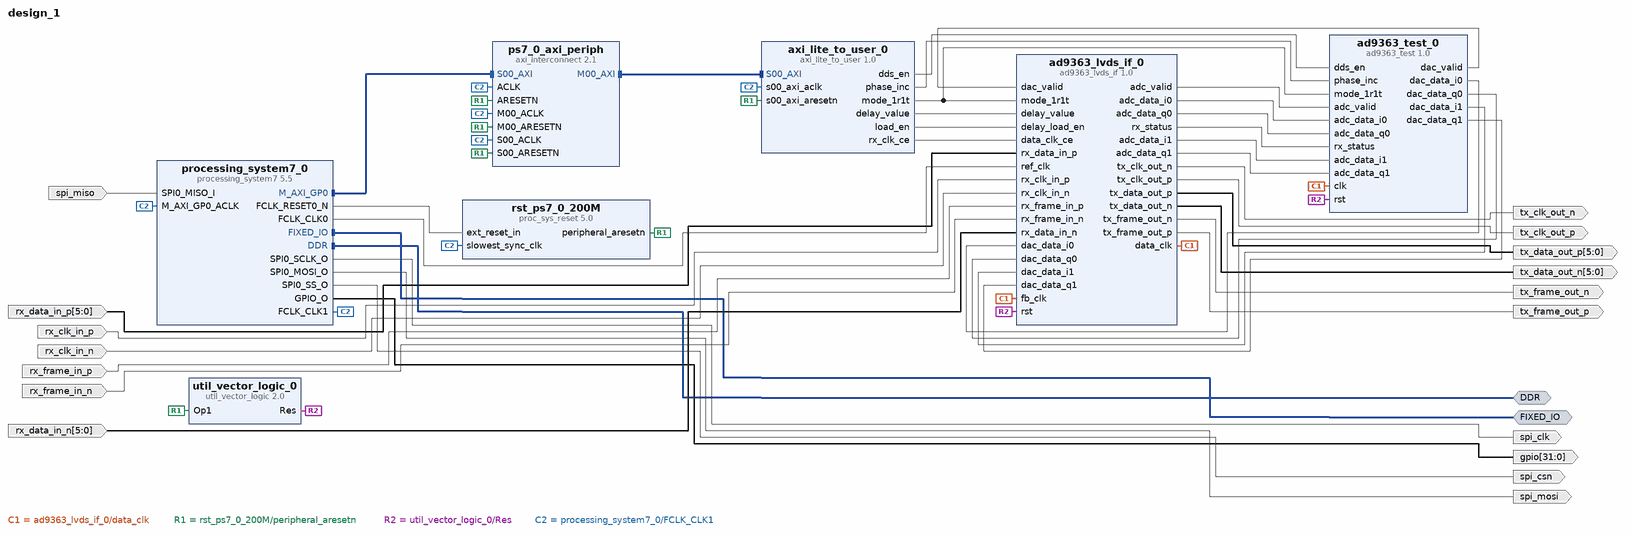
[diagram p0: block diagram of the top level]
# Vivado block design design_1, xc7z020clg400-2, Vivado 2019.2
create_bd_design design_1

create_bd_intf_port -mode Master -vlnv xilinx.com:interface:ddrx_rtl:1.0 DDR
create_bd_intf_port -mode Master -vlnv xilinx.com:display_processing_system7:fixedio_rtl:1.0 FIXED_IO
create_bd_port -dir O spi_clk
create_bd_port -dir O spi_mosi
create_bd_port -dir I spi_miso
create_bd_port -dir O spi_csn
create_bd_port -dir O -from 5 -to 0 tx_data_out_p
create_bd_port -dir O tx_clk_out_p
create_bd_port -dir O tx_clk_out_n
create_bd_port -dir O tx_frame_out_p
create_bd_port -dir O tx_frame_out_n
create_bd_port -dir O -from 5 -to 0 tx_data_out_n
create_bd_port -dir I -from 5 -to 0 rx_data_in_p
create_bd_port -dir I rx_clk_in_p
create_bd_port -dir I rx_clk_in_n
create_bd_port -dir I rx_frame_in_p
create_bd_port -dir I rx_frame_in_n
create_bd_port -dir I -from 5 -to 0 rx_data_in_n
create_bd_port -dir O -from 31 -to 0 gpio

create_bd_cell -type ip -vlnv xilinx.com:ip:processing_system7:5.5 processing_system7_0
set_property -dict [list \
  CONFIG.PCW_ENET0_ENET0_IO {MIO 16 .. 27} \
  CONFIG.PCW_ENET0_GRP_MDIO_ENABLE 1 \
  CONFIG.PCW_ENET0_GRP_MDIO_IO {MIO 52 .. 53} \
  CONFIG.PCW_ENET0_PERIPHERAL_ENABLE 1 \
  CONFIG.PCW_ENET0_RESET_ENABLE 1 \
  CONFIG.PCW_ENET0_RESET_IO {MIO 46} \
  CONFIG.PCW_ENET_RESET_ENABLE 1 \
  CONFIG.PCW_ENET_RESET_SELECT {Share reset pin} \
  CONFIG.PCW_EN_CLK1_PORT 1 \
  CONFIG.PCW_FCLK_CLK1_BUF TRUE \
  CONFIG.PCW_FPGA0_PERIPHERAL_FREQMHZ 200 \
  CONFIG.PCW_FPGA1_PERIPHERAL_FREQMHZ 40 \
  CONFIG.PCW_FPGA_FCLK1_ENABLE 1 \
  CONFIG.PCW_GPIO_EMIO_GPIO_ENABLE 1 \
  CONFIG.PCW_GPIO_EMIO_GPIO_IO 32 \
  CONFIG.PCW_GPIO_EMIO_GPIO_WIDTH 32 \
  CONFIG.PCW_GPIO_MIO_GPIO_ENABLE 1 \
  CONFIG.PCW_GPIO_MIO_GPIO_IO MIO \
  CONFIG.PCW_I2C_RESET_ENABLE 0 \
  CONFIG.PCW_PRESET_BANK1_VOLTAGE {LVCMOS 1.8V} \
  CONFIG.PCW_SD0_GRP_CD_ENABLE 0 \
  CONFIG.PCW_SD0_GRP_WP_ENABLE 0 \
  CONFIG.PCW_SD0_PERIPHERAL_ENABLE 1 \
  CONFIG.PCW_SD0_SD0_IO {MIO 40 .. 45} \
  CONFIG.PCW_SDIO_PERIPHERAL_FREQMHZ 100 \
  CONFIG.PCW_SPI0_PERIPHERAL_ENABLE 1 \
  CONFIG.PCW_SPI0_SPI0_IO EMIO \
  CONFIG.PCW_UART1_PERIPHERAL_ENABLE 1 \
  CONFIG.PCW_UART1_UART1_IO {MIO 12 .. 13} \
  CONFIG.PCW_UART_PERIPHERAL_FREQMHZ 100 \
  CONFIG.PCW_UIPARAM_DDR_BUS_WIDTH {16 Bit} \
  CONFIG.PCW_UIPARAM_DDR_PARTNO {MT41J256M16 RE-125} \
  CONFIG.PCW_USB0_PERIPHERAL_ENABLE 1 \
  CONFIG.PCW_USB0_RESET_ENABLE 1 \
  CONFIG.PCW_USB0_RESET_IO {MIO 47} \
  CONFIG.PCW_USB0_USB0_IO {MIO 28 .. 39} \
  CONFIG.PCW_USB_RESET_ENABLE 1 \
  CONFIG.PCW_USB_RESET_SELECT {Share reset pin} \
] [get_bd_cells processing_system7_0]
# 205 more settings of processing_system7_0 are not shown: defaults, MIO pin electricals, DDR timing, and values the tool derives
create_bd_cell -type ip -vlnv xilinx.com:ip:axi_interconnect:2.1 ps7_0_axi_periph
set_property -dict {CONFIG.NUM_MI 1} [get_bd_cells ps7_0_axi_periph]
create_bd_cell -type ip -vlnv xilinx.com:ip:proc_sys_reset:5.0 rst_ps7_0_200M
create_bd_cell -type ip -vlnv xilinx.com:ip:util_vector_logic:2.0 util_vector_logic_0
set_property -dict {CONFIG.C_OPERATION not CONFIG.C_SIZE 1} [get_bd_cells util_vector_logic_0]
create_bd_cell -type ip -vlnv xilinx.com:user:ad9363_lvds_if:1.0 ad9363_lvds_if_0
create_bd_cell -type ip -vlnv xilinx.com:user:axi_lite_to_user:1.0 axi_lite_to_user_0
create_bd_cell -type ip -vlnv xilinx.com:user:ad9363_test:1.0 ad9363_test_0

# ---- connections ----

connect_bd_intf_net [get_bd_intf_pins processing_system7_0/M_AXI_GP0] [get_bd_intf_pins ps7_0_axi_periph/S00_AXI]
connect_bd_intf_net [get_bd_intf_pins ps7_0_axi_periph/M00_AXI] [get_bd_intf_pins axi_lite_to_user_0/S00_AXI]
connect_bd_intf_net [get_bd_intf_ports FIXED_IO] [get_bd_intf_pins processing_system7_0/FIXED_IO]
connect_bd_intf_net [get_bd_intf_ports DDR] [get_bd_intf_pins processing_system7_0/DDR]
connect_bd_net [get_bd_pins processing_system7_0/SPI0_SCLK_O] [get_bd_ports spi_clk]
connect_bd_net [get_bd_pins processing_system7_0/SPI0_MOSI_O] [get_bd_ports spi_mosi]
connect_bd_net -net SPI0_MISO_I_0_1 [get_bd_ports spi_miso] [get_bd_pins processing_system7_0/SPI0_MISO_I]
connect_bd_net [get_bd_pins processing_system7_0/SPI0_SS_O] [get_bd_ports spi_csn]
connect_bd_net [get_bd_pins ad9363_lvds_if_0/tx_data_out_p] [get_bd_ports tx_data_out_p]
connect_bd_net [get_bd_pins ad9363_lvds_if_0/tx_clk_out_p] [get_bd_ports tx_clk_out_p]
connect_bd_net [get_bd_pins ad9363_lvds_if_0/tx_clk_out_n] [get_bd_ports tx_clk_out_n]
connect_bd_net [get_bd_pins ad9363_lvds_if_0/tx_frame_out_p] [get_bd_ports tx_frame_out_p]
connect_bd_net [get_bd_pins ad9363_lvds_if_0/tx_frame_out_n] [get_bd_ports tx_frame_out_n]
connect_bd_net [get_bd_pins ad9363_lvds_if_0/tx_data_out_n] [get_bd_ports tx_data_out_n]
connect_bd_net -net rx_data_in_p_0_1 [get_bd_ports rx_data_in_p] [get_bd_pins ad9363_lvds_if_0/rx_data_in_p]
connect_bd_net -net rx_clk_in_p_0_1 [get_bd_ports rx_clk_in_p] [get_bd_pins ad9363_lvds_if_0/rx_clk_in_p]
connect_bd_net -net rx_clk_in_n_0_1 [get_bd_ports rx_clk_in_n] [get_bd_pins ad9363_lvds_if_0/rx_clk_in_n]
connect_bd_net -net rx_frame_in_p_0_1 [get_bd_ports rx_frame_in_p] [get_bd_pins ad9363_lvds_if_0/rx_frame_in_p]
connect_bd_net -net rx_frame_in_n_0_1 [get_bd_ports rx_frame_in_n] [get_bd_pins ad9363_lvds_if_0/rx_frame_in_n]
connect_bd_net -net rx_data_in_n_0_1 [get_bd_ports rx_data_in_n] [get_bd_pins ad9363_lvds_if_0/rx_data_in_n]
connect_bd_net [get_bd_pins ad9363_lvds_if_0/data_clk] [get_bd_pins ad9363_lvds_if_0/fb_clk] [get_bd_pins ad9363_test_0/clk]
connect_bd_net [get_bd_pins ad9363_test_0/dac_valid] [get_bd_pins ad9363_lvds_if_0/dac_valid]
connect_bd_net [get_bd_pins ad9363_test_0/dac_data_i0] [get_bd_pins ad9363_lvds_if_0/dac_data_i0]
connect_bd_net [get_bd_pins ad9363_test_0/dac_data_q0] [get_bd_pins ad9363_lvds_if_0/dac_data_q0]
connect_bd_net [get_bd_pins ad9363_lvds_if_0/adc_valid] [get_bd_pins ad9363_test_0/adc_valid]
connect_bd_net [get_bd_pins ad9363_lvds_if_0/adc_data_i0] [get_bd_pins ad9363_test_0/adc_data_i0]
connect_bd_net [get_bd_pins ad9363_lvds_if_0/adc_data_q0] [get_bd_pins ad9363_test_0/adc_data_q0]
connect_bd_net [get_bd_pins ad9363_lvds_if_0/rx_status] [get_bd_pins ad9363_test_0/rx_status]
connect_bd_net [get_bd_pins axi_lite_to_user_0/delay_value] [get_bd_pins ad9363_lvds_if_0/delay_value]
connect_bd_net [get_bd_pins axi_lite_to_user_0/load_en] [get_bd_pins ad9363_lvds_if_0/delay_load_en]
connect_bd_net [get_bd_pins axi_lite_to_user_0/rx_clk_ce] [get_bd_pins ad9363_lvds_if_0/data_clk_ce]
connect_bd_net [get_bd_pins axi_lite_to_user_0/dds_en] [get_bd_pins ad9363_test_0/dds_en]
connect_bd_net [get_bd_pins axi_lite_to_user_0/phase_inc] [get_bd_pins ad9363_test_0/phase_inc]
connect_bd_net [get_bd_pins processing_system7_0/FCLK_RESET0_N] [get_bd_pins rst_ps7_0_200M/ext_reset_in]
connect_bd_net [get_bd_pins rst_ps7_0_200M/peripheral_aresetn] \
  [get_bd_pins ps7_0_axi_periph/S00_ARESETN] [get_bd_pins ps7_0_axi_periph/M00_ARESETN] \
  [get_bd_pins ps7_0_axi_periph/ARESETN] [get_bd_pins util_vector_logic_0/Op1] \
  [get_bd_pins axi_lite_to_user_0/s00_axi_aresetn]
connect_bd_net [get_bd_pins util_vector_logic_0/Res] [get_bd_pins ad9363_lvds_if_0/rst] [get_bd_pins ad9363_test_0/rst]
connect_bd_net [get_bd_pins processing_system7_0/GPIO_O] [get_bd_ports gpio]
connect_bd_net [get_bd_pins processing_system7_0/FCLK_CLK0] [get_bd_pins ad9363_lvds_if_0/ref_clk]
connect_bd_net [get_bd_pins processing_system7_0/FCLK_CLK1] \
  [get_bd_pins processing_system7_0/M_AXI_GP0_ACLK] [get_bd_pins rst_ps7_0_200M/slowest_sync_clk] \
  [get_bd_pins ps7_0_axi_periph/ACLK] [get_bd_pins ps7_0_axi_periph/S00_ACLK] [get_bd_pins ps7_0_axi_periph/M00_ACLK] \
  [get_bd_pins axi_lite_to_user_0/s00_axi_aclk]
connect_bd_net [get_bd_pins ad9363_test_0/dac_data_i1] [get_bd_pins ad9363_lvds_if_0/dac_data_i1]
connect_bd_net [get_bd_pins ad9363_test_0/dac_data_q1] [get_bd_pins ad9363_lvds_if_0/dac_data_q1]
connect_bd_net [get_bd_pins ad9363_lvds_if_0/adc_data_i1] [get_bd_pins ad9363_test_0/adc_data_i1]
connect_bd_net [get_bd_pins ad9363_lvds_if_0/adc_data_q1] [get_bd_pins ad9363_test_0/adc_data_q1]
connect_bd_net [get_bd_pins axi_lite_to_user_0/mode_1r1t] [get_bd_pins ad9363_lvds_if_0/mode_1r1t] [get_bd_pins ad9363_test_0/mode_1r1t]

# ---- address map ----
assign_bd_address -offset 0x43C00000 -range 64K -target_address_space [get_bd_addr_spaces processing_system7_0/Data] [get_bd_addr_segs axi_lite_to_user_0/S00_AXI/S00_AXI_reg]

validate_bd_design
save_bd_design
